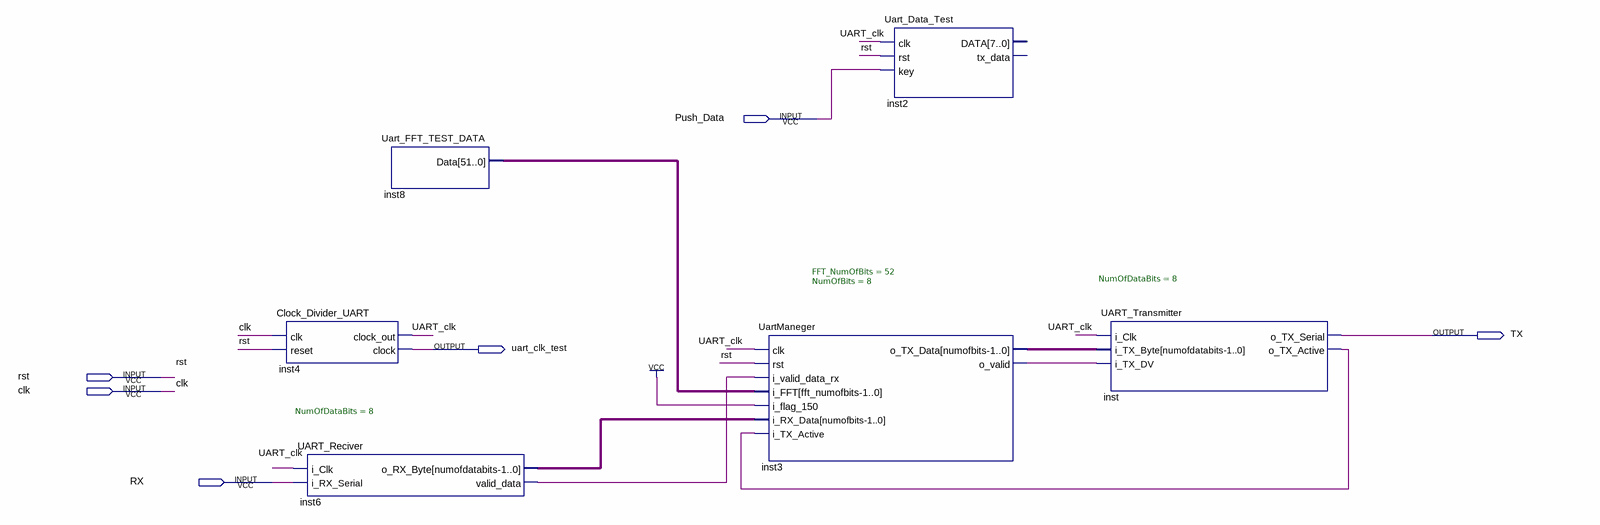
[diagram p0: schematic sheet]
// Quartus schematic Uart_BDF.bdf as structural Verilog: 6 symbols, 6 pins
module Uart_BDF (
  input  Push_Data,
  input  rst,
  input  clk,
  input  RX,
  output TX,
  output uart_clk_test
);

  wire inst3_o_valid, inst6_valid_data, inst_o_tx_active, UART_clk;
  wire [7:0] inst3_o_tx_data, inst6_o_rx_byte;
  wire [51:0] inst8_data;

  Clock_Divider_UART inst4 (.clk(clk), .reset(rst), .clock_out(UART_clk), .clock(uart_clk_test));
  UART_Reciver #(.NumOfDataBits(8)) inst6 (
    .i_Clk(UART_clk), .i_RX_Serial(RX), .o_RX_Byte(inst6_o_rx_byte), .valid_data(inst6_valid_data));
  Uart_FFT_TEST_DATA inst8 (.Data(inst8_data));
  UartManeger #(.FFT_NumOfBits(52), .NumOfBits(8)) inst3 (
    .clk(UART_clk), .rst(rst), .i_valid_data_rx(inst6_valid_data), .i_FFT(inst8_data), .i_flag_150(1'b1),
    .i_RX_Data(inst6_o_rx_byte), .i_TX_Active(inst_o_tx_active), .o_TX_Data(inst3_o_tx_data),
    .o_valid(inst3_o_valid));
  Uart_Data_Test inst2 (.clk(UART_clk), .rst(rst), .key(Push_Data));  // open: DATA, tx_data
  UART_Transmitter #(.NumOfDataBits(8)) inst (
    .i_Clk(UART_clk), .i_TX_Byte(inst3_o_tx_data), .i_TX_DV(inst3_o_valid), .o_TX_Serial(TX),
    .o_TX_Active(inst_o_tx_active));
endmodule
